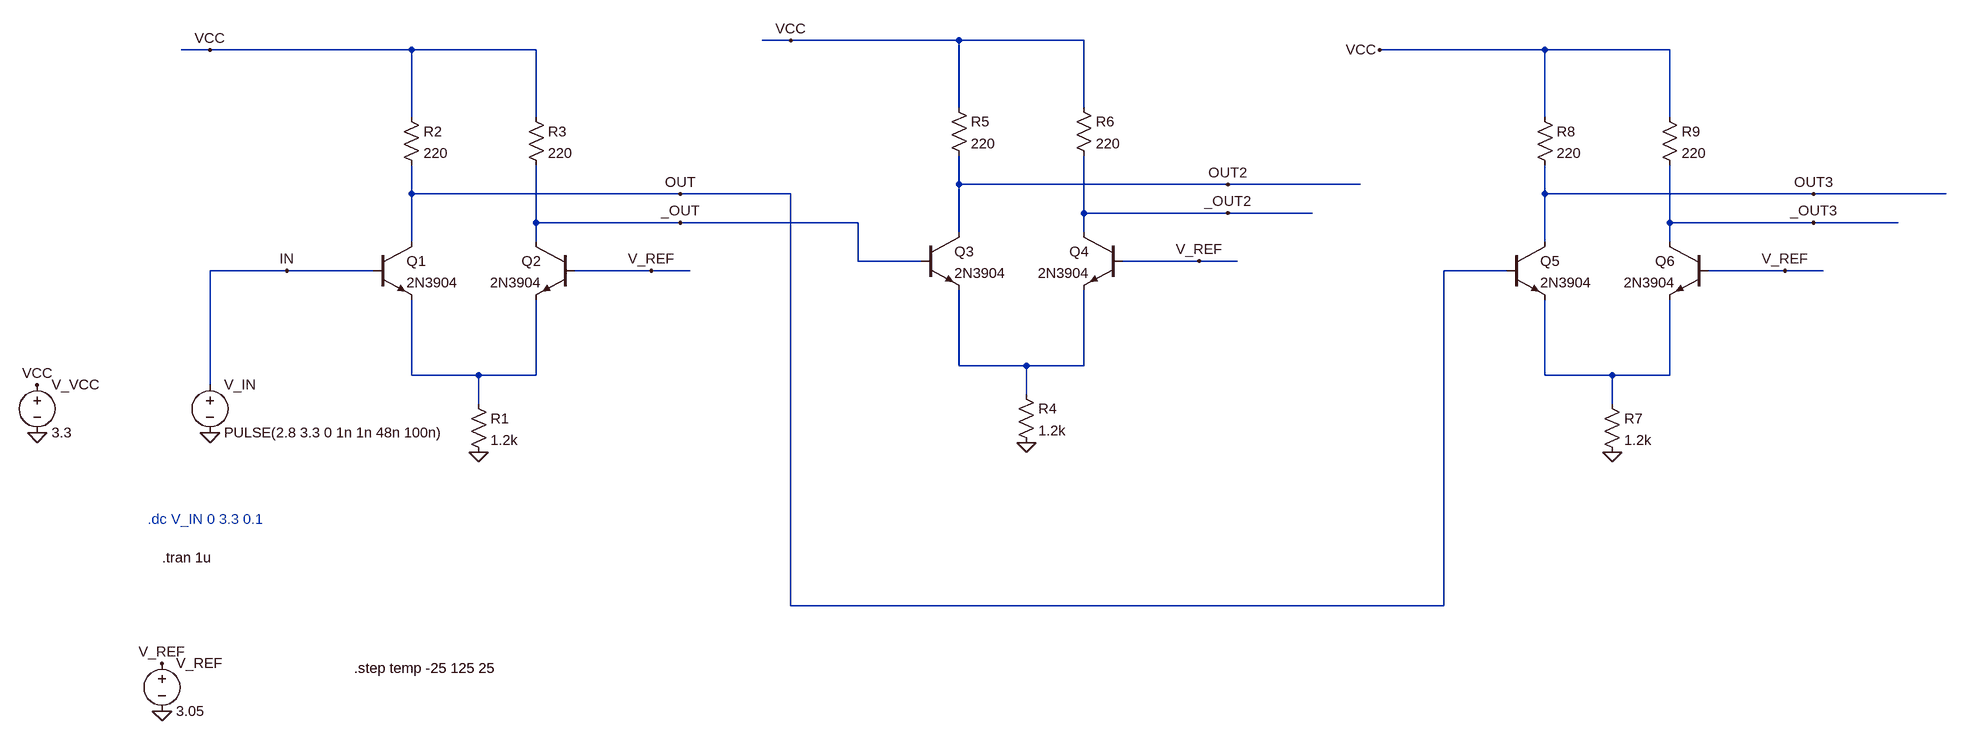
[diagram p0: schematic bmecl_gates.asc]
bmecl_gates.asc, the LTspice schematic file:
Version 4
SHEET 1 2692 740
WIRE 640 -400 592 -400
WIRE 976 -400 640 -400
WIRE 1184 -400 976 -400
WIRE -368 -384 -416 -384
WIRE -32 -384 -368 -384
WIRE 176 -384 -32 -384
WIRE 2016 -384 1680 -384
WIRE 2224 -384 2016 -384
WIRE 976 -288 976 -400
WIRE 1184 -288 1184 -400
WIRE -32 -272 -32 -384
WIRE 176 -272 176 -384
WIRE 2016 -272 2016 -384
WIRE 2224 -272 2224 -384
WIRE 976 -160 976 -208
WIRE 1424 -160 976 -160
WIRE 1648 -160 1424 -160
WIRE -32 -144 -32 -192
WIRE 416 -144 -32 -144
WIRE 640 -144 416 -144
WIRE 2016 -144 2016 -192
WIRE 2464 -144 2016 -144
WIRE 2688 -144 2464 -144
WIRE 1184 -112 1184 -208
WIRE 1424 -112 1184 -112
WIRE 1568 -112 1424 -112
WIRE 176 -96 176 -192
WIRE 416 -96 176 -96
WIRE 752 -96 416 -96
WIRE 2224 -96 2224 -192
WIRE 2464 -96 2224 -96
WIRE 2608 -96 2464 -96
WIRE 976 -80 976 -160
WIRE 1184 -80 1184 -112
WIRE -32 -64 -32 -144
WIRE 176 -64 176 -96
WIRE 2016 -64 2016 -144
WIRE 2224 -64 2224 -96
WIRE 752 -32 752 -96
WIRE 912 -32 752 -32
WIRE 1376 -32 1248 -32
WIRE 1440 -32 1376 -32
WIRE -240 -16 -368 -16
WIRE -96 -16 -240 -16
WIRE 368 -16 240 -16
WIRE 432 -16 368 -16
WIRE 1952 -16 1792 -16
WIRE 2416 -16 2288 -16
WIRE 2480 -16 2416 -16
WIRE 976 144 976 16
WIRE 1088 144 976 144
WIRE 1184 144 1184 16
WIRE 1184 144 1088 144
WIRE -32 160 -32 32
WIRE 80 160 -32 160
WIRE 176 160 176 32
WIRE 176 160 80 160
WIRE 2016 160 2016 32
WIRE 2128 160 2016 160
WIRE 2224 160 2224 32
WIRE 2224 160 2128 160
WIRE -368 176 -368 -16
WIRE 1088 192 1088 144
WIRE 80 208 80 160
WIRE 2128 208 2128 160
WIRE 640 544 640 -144
WIRE 1792 544 1792 -16
WIRE 1792 544 640 544
FLAG 80 288 0
FLAG -656 256 0
FLAG -368 256 0
FLAG -448 720 0
FLAG -656 176 VCC
FLAG -368 -384 VCC
FLAG -240 -16 IN
FLAG 416 -144 OUT
FLAG 416 -96 _OUT
FLAG 368 -16 V_REF
FLAG -448 640 V_REF
FLAG 1088 272 0
FLAG 640 -400 VCC
FLAG 1424 -160 OUT2
FLAG 1424 -112 _OUT2
FLAG 1376 -32 V_REF
FLAG 2128 288 0
FLAG 1680 -384 VCC
FLAG 2464 -144 OUT3
FLAG 2464 -96 _OUT3
FLAG 2416 -16 V_REF
SYMBOL npn -96 -64 R0
SYMATTR InstName Q1
SYMATTR Value 2N3904
SYMBOL npn 240 -64 M0
SYMATTR InstName Q2
SYMATTR Value 2N3904
SYMBOL res 64 192 R0
SYMATTR InstName R1
SYMATTR Value 1.2k
SYMBOL res -48 -288 R0
SYMATTR InstName R2
SYMATTR Value 220
SYMBOL res 160 -288 R0
SYMATTR InstName R3
SYMATTR Value 220
SYMBOL voltage -368 160 R0
WINDOW 123 0 0 Left 0
WINDOW 39 0 0 Left 0
SYMATTR InstName V_IN
SYMATTR Value PULSE(2.8 3.3 0 1n 1n 48n 100n)
SYMBOL voltage -448 624 R0
SYMATTR InstName V_REF
SYMATTR Value 3.05
SYMBOL voltage -656 160 R0
SYMATTR InstName V_VCC
SYMATTR Value 3.3
SYMBOL npn 912 -80 R0
SYMATTR InstName Q3
SYMATTR Value 2N3904
SYMBOL npn 1248 -80 M0
SYMATTR InstName Q4
SYMATTR Value 2N3904
SYMBOL res 1072 176 R0
SYMATTR InstName R4
SYMATTR Value 1.2k
SYMBOL res 960 -304 R0
SYMATTR InstName R5
SYMATTR Value 220
SYMBOL res 1168 -304 R0
SYMATTR InstName R6
SYMATTR Value 220
SYMBOL npn 1952 -64 R0
SYMATTR InstName Q5
SYMATTR Value 2N3904
SYMBOL npn 2288 -64 M0
SYMATTR InstName Q6
SYMATTR Value 2N3904
SYMBOL res 2112 192 R0
SYMATTR InstName R7
SYMATTR Value 1.2k
SYMBOL res 2000 -288 R0
SYMATTR InstName R8
SYMATTR Value 220
SYMBOL res 2208 -288 R0
SYMATTR InstName R9
SYMATTR Value 220
TEXT -472 400 Left 2 ;.dc V_IN 0 3.3 0.1
TEXT -448 464 Left 2 !.tran 1u
TEXT -128 648 Left 2 !.step temp -25 125 25

The netlist it stands for:
* bmecl_gates.asc
Q1 OUT IN N002 0 2N3904
Q2 _OUT V_REF N002 0 2N3904
R1 N002 0 1.2k
R2 VCC OUT 220
R3 VCC _OUT 220
V_IN IN 0 PULSE(2.8 3.3 0 1n 1n 48n 100n)
V_REF V_REF 0 3.05
V_VCC VCC 0 3.3
Q3 OUT2 _OUT N001 0 2N3904
Q4 _OUT2 V_REF N001 0 2N3904
R4 N001 0 1.2k
R5 VCC OUT2 220
R6 VCC _OUT2 220
Q5 OUT3 OUT N003 0 2N3904
Q6 _OUT3 V_REF N003 0 2N3904
R7 N003 0 1.2k
R8 VCC OUT3 220
R9 VCC _OUT3 220
.model NPN NPN
.model PNP PNP
.lib standard.bjt
* .dc V_IN 0 3.3 0.1
.tran 1u
.step temp -25 125 25
.backanno
.end